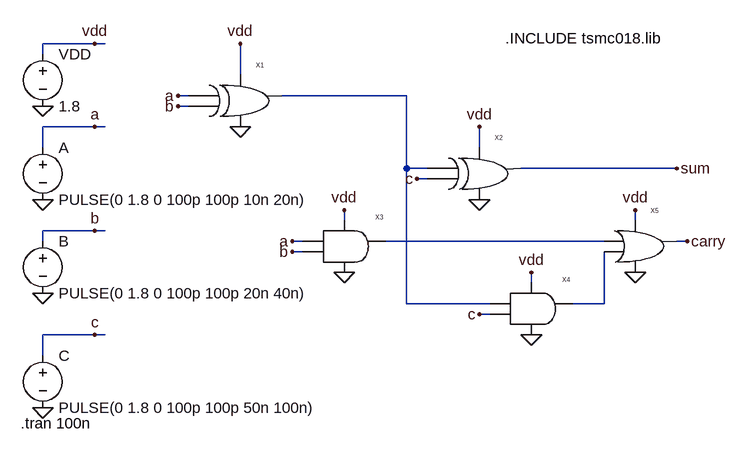
[diagram p0: schematic full_adder.asc]
full_adder.asc, the LTspice schematic file:
Version 4
SHEET 1 880 680
WIRE -128 16 -208 16
WIRE -112 16 -128 16
WIRE -208 32 -208 16
WIRE 96 64 96 16
WIRE 16 96 0 96
WIRE 352 96 160 96
WIRE 16 112 0 112
WIRE -128 144 -208 144
WIRE -112 144 -128 144
WIRE -208 176 -208 144
WIRE 464 176 464 144
WIRE 352 208 352 96
WIRE 384 208 352 208
WIRE 768 208 528 208
WIRE 384 224 368 224
WIRE 256 288 256 272
WIRE 704 288 704 272
WIRE -128 304 -208 304
WIRE -112 304 -128 304
WIRE -208 320 -208 304
WIRE 192 320 176 320
WIRE 656 320 320 320
WIRE 784 320 768 320
WIRE 192 336 176 336
WIRE 544 384 544 368
WIRE 352 416 352 208
WIRE 480 416 352 416
WIRE 656 416 656 336
WIRE 656 416 608 416
WIRE 480 432 464 432
WIRE -128 464 -208 464
WIRE -112 464 -128 464
WIRE -208 496 -208 464
FLAG -208 112 0
FLAG -208 256 0
FLAG -208 400 0
FLAG -208 576 0
FLAG 464 256 0
FLAG 96 144 0
FLAG 256 368 0
FLAG 544 464 0
FLAG -128 16 vdd
FLAG 96 16 vdd
FLAG 464 144 vdd
FLAG 256 272 vdd
FLAG 544 368 vdd
FLAG -128 144 a
FLAG 0 96 a
FLAG 176 320 a
FLAG -128 304 b
FLAG 0 112 b
FLAG 176 336 b
FLAG -128 464 c
FLAG 464 432 c
FLAG 368 224 c
FLAG 704 368 0
FLAG 704 272 vdd
FLAG 768 208 sum
FLAG 784 320 carry
SYMBOL xor 144 112 R0
SYMATTR InstName X1
SYMBOL xor 512 224 R0
SYMATTR InstName X2
SYMBOL voltage -208 16 R0
WINDOW 123 0 0 Left 0
WINDOW 39 0 0 Left 0
SYMATTR InstName VDD
SYMATTR Value 1.8
SYMBOL voltage -208 160 R0
WINDOW 123 0 0 Left 0
WINDOW 39 0 0 Left 0
SYMATTR InstName A
SYMATTR Value PULSE(0 1.8 0 100p 100p 10n 20n)
SYMBOL voltage -208 304 R0
WINDOW 123 0 0 Left 0
WINDOW 39 0 0 Left 0
SYMATTR InstName B
SYMATTR Value PULSE(0 1.8 0 100p 100p 20n 40n)
SYMBOL voltage -208 480 R0
WINDOW 123 0 0 Left 0
WINDOW 39 0 0 Left 0
SYMATTR InstName C
SYMATTR Value PULSE(0 1.8 0 100p 100p 50n 100n)
SYMBOL and 304 336 R0
SYMATTR InstName X3
SYMBOL and 592 432 R0
SYMATTR InstName X4
SYMBOL or 752 336 R0
SYMATTR InstName X5
TEXT 504 8 Left 2 !.INCLUDE tsmc018.lib
TEXT -242 600 Left 2 !.tran 100n

The netlist it stands for:
* full_adder.asc
XX1 a b vdd 0 N001 xor  ; pins A B vdd vss Vout
XX2 N001 c vdd 0 sum xor  ; pins A B vdd vss Vout
VDD vdd 0 1.8
V§A a 0 PULSE(0 1.8 0 100p 100p 10n 20n)
V§B b 0 PULSE(0 1.8 0 100p 100p 20n 40n)
V§C c 0 PULSE(0 1.8 0 100p 100p 50n 100n)
XX3 a b vdd 0 N002 and  ; pins a b vdd vss And
XX4 N001 c vdd 0 N003 and  ; pins a b vdd vss And
XX5 N002 N003 vdd 0 carry or  ; pins a b vdd vss Vout
.INCLUDE tsmc018.lib
.tran 100n
.backanno
.end